# Altium schematic sheet Bluetooth.SchDoc
size A4
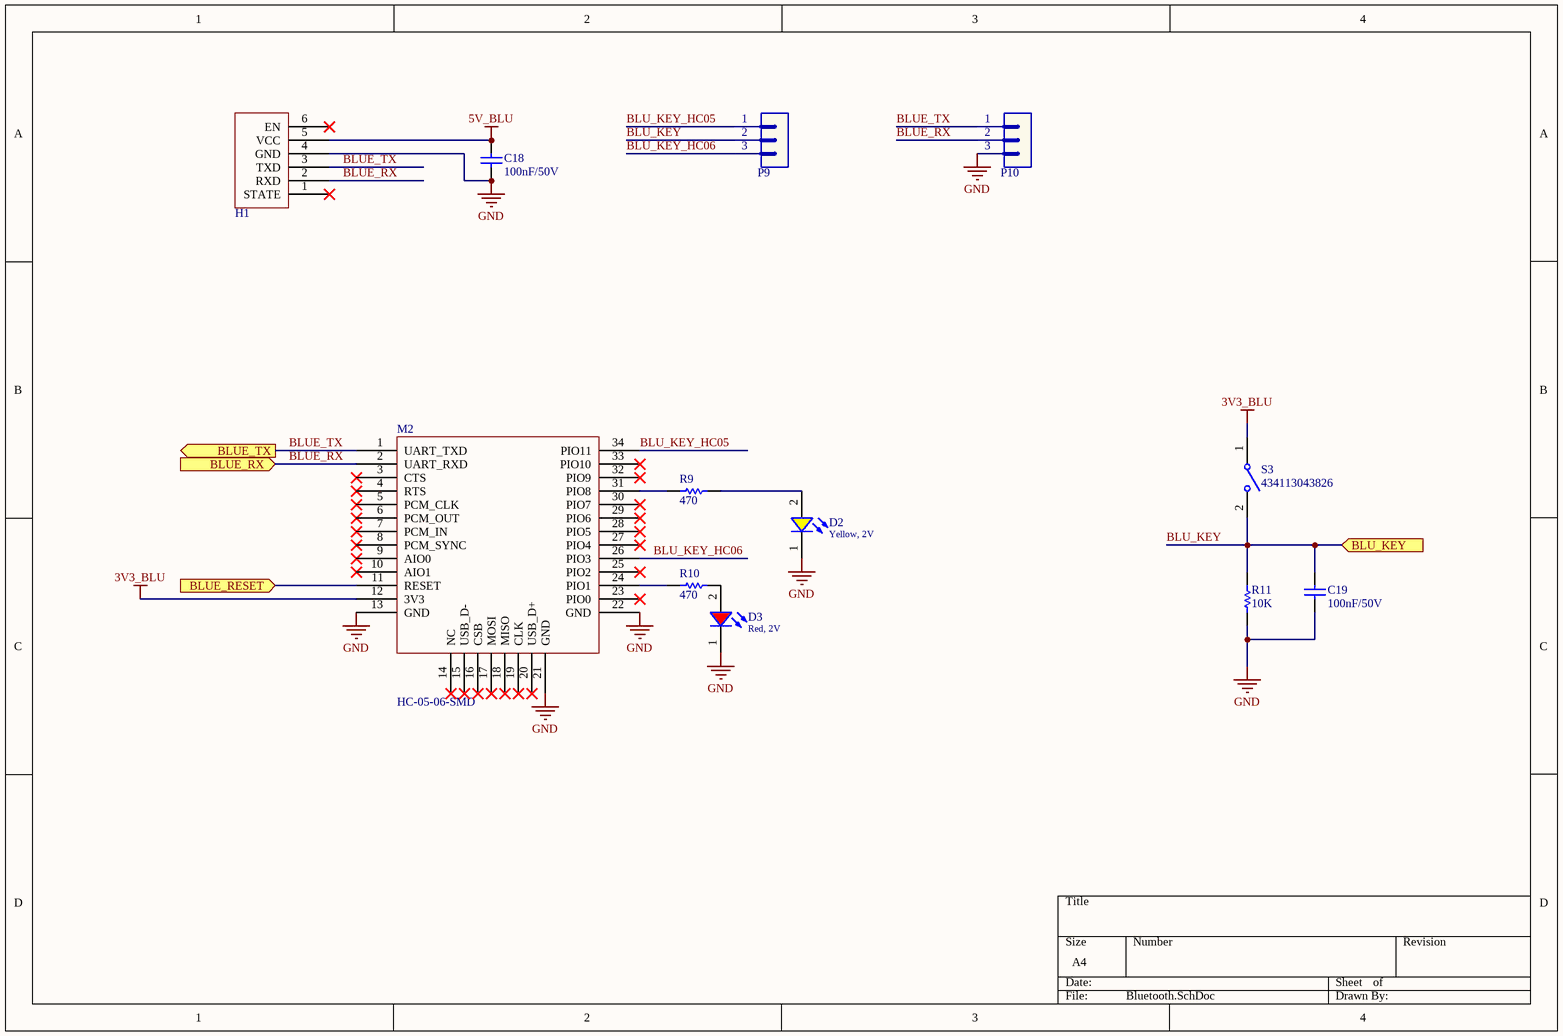
[diagram p0: Bluetooth.SchDoc]

## Parts
C18  value 100nF/50V  [CAP-SM-0805]  (hidden comment: Cap-100nF-50V-0805)
C19  value 100nF/50V  [CAP-SM-0805]  (hidden comment: Cap-100nF-50V-0805)
D2  Yellow, 2V  [WL-SMCW_0805]
D3  Red, 2V  [WL-SMCW_0805]
H1  HC-05-06-TH  [HC-05-06-TH]  (value not drawn)
M2  HC-05-06-SMD  [HC-05-06-SMD]
P9  Header 3  [JP3]  (value not drawn)
P10  Header 3  [JP3]  (value not drawn)
R9  value 470  [RES-SM-0805]  (hidden comment: Res-470-0805)
R10  value 470  [RES-SM-0805]  (hidden comment: Res-470-0805)
R11  value 10K  [RES-SM-0805]  (hidden comment: Res-10k-0805)
S3  434113043826  [434113043826]

## Ports
BLU_KEY (in), BLUE_RESET (in), BLUE_RX (in), BLUE_TX (out)

## Nets
3V3_BLU: M2.12(3V3) S3.1
5V_BLU: C18.2 H1.5(VCC)
GND: C18.1 C19.2 D2.1(K) D3.1(K) H1.4(GND) M2.13(GND) M2.21(GND) M2.22(GND) P10.3 R11.1
BLU_KEY: C19.1 P9.2 R11.2 S3.2 ; port BLU_KEY
BLU_KEY_HC05: M2.34(PIO11) P9.1
BLU_KEY_HC06: M2.26(PIO3) P9.3
BLUE_RESET: M2.11(RESET) ; port BLUE_RESET
BLUE_RX: H1.2(RXD) M2.2(UART_RXD) P10.2 ; port BLUE_RX
BLUE_TX: H1.3(TXD) M2.1(UART_TXD) P10.1 ; port BLUE_TX
NetD2_2: D2.2(A) R9.2
NetD3_2: D3.2(A) R10.2
NetM2_24: M2.24(PIO1) R10.1
NetM2_31: M2.31(PIO8) R9.1

Not connected (* = marked no-connect by the designer): H1 1(STATE)* 6(EN)*; M2 3(CTS)* 4(RTS)* 5(PCM_CLK)* 6(PCM_OUT)* 7(PCM_IN)* 8(PCM_SYNC)* 9(AIO0)* 10(AIO1)* 14(NC)* 15(USB_D-)* 16(CSB)* 17(MOSI)* 18(MISO)* 19(CLK)* 20(USB_D+)* 23(PIO0)* 25(PIO2)* 27(PIO4)* 28(PIO5)* 29(PIO6)* 30(PIO7)* 32(PIO9)* 33(PIO10)*

## Library data of the parts
C18 C19 = Cap-100nF-50V-0805: CAP CER 0.1UF 50V Y5V 0805; Manufacturer: Samsung Electro-Mechanics; Manufacturer Part Number: CL21F104ZBCNNNC; Local Supplier: thegioiic; Local Supplier Link: https://thegioiic.com/products/tu-100nf-0-1uf-50v-0805; Supplier 1: Digikey; Supplier 1 Part Number: 1276-1007-1-ND; Supplier 1 Link: https://www.digikey.com/product-detail/en/samsung-electro-mechanics/CL21F104ZBCNNNC/1276-1007-1-ND/3889093
D2 = 150080YS75000: WL-SMCW SMT Mono-color Chip LED Waterclear, size 0805, Yellow, 2V, 140deg; Chip Technology: AlInGaP; Dominant Wavelength typ.: 590nm; Luminous Intensity typ.: 120mcd; Peak Wavelength typ.: 595nm; Viewing Angle: 140deg; ComponentLink1Description: Manufacturer; ComponentLink1URL: http://www.we-online.de; ComponentLink2URL: https://www.we-online.com/catalog/datasheet/150080YS75000.pdf; ComponentLink2Description: Datasheet; Forward Voltage typ.: 2V; Emitting Color: Yellow; Mounting Technology: SMT; Operating Temperature: -40 to +85degC; Published Date: December 2019; Part Number: 150080YS75000; Packaging: Tape and Reel; Size: 0805; Publisher: Wurth Elektronik
D3 = 150080RS75000: WL-SMCW SMT Mono-color Chip LED Waterclear, size 0805, Red, 2V, 140deg; Chip Technology: AlInGaP; Dominant Wavelength typ.: 625nm; Luminous Intensity typ.: 150mcd; Peak Wavelength typ.: 630nm; Viewing Angle: 140deg; ComponentLink1Description: Manufacturer; ComponentLink1URL: http://www.we-online.de; ComponentLink2URL: https://www.we-online.com/catalog/datasheet/150080RS75000.pdf; ComponentLink2Description: Datasheet; Forward Voltage typ.: 2V; Emitting Color: Red; Mounting Technology: SMT; Operating Temperature: -40 to +85degC; Published Date: December 2019; Part Number: 150080RS75000; Packaging: Tape and Reel; Size: 0805; Publisher: Wurth Elektronik
P9 P10 = Header 3: Header, 3-Pin; LatestRevisionDate: 17-Jul-2002; LatestRevisionNote: Re-released for DXP Platform.; Publisher: Altium Limited
R9 R10 = Res-470-0805: RES 470 OHM JUMPER 0805; Manufacturer: YAG6006CT-ND; Manufacturer Part Number: PE0805FRF7W0R047L; Local Supplier: thegioiic; Local Supplier Link: https://www.thegioiic.com/products/dien-tro-470-kohm-0805-5; Supplier 1: Digikey; Supplier 1 Link: https://www.digikey.com/product-detail/en/yageo/PE0805FRF7W0R047L/YAG6006CT-ND/9696460; Supplier 1 Part Number: YAG6006CT-ND
R11 = Res-10k-0805: RES 10K OHM 1% 1/4W 0805; Manufacturer: Stackpole Electronics Inc; Manufacturer Part Number: RNCP0805FTD10K0; Local Supplier: thegioiic; Local Supplier Link: https://thegioiic.com/products/dien-tro-10k-ohm-0805-5; Supplier 1: Digikey; Supplier 1 Link: https://www.digikey.com/product-detail/en/stackpole-electronics-inc/RNCP0805FTD10K0/RNCP0805FTD10K0CT-ND/2240601; Supplier 1 Part Number: RNCP0805FTD10K0CT-ND
S3 = 434113043826: WS-TASV J-Bend SMT Tact Switch 6x3.5mm, height 4.3mm, 260gf; Rated Voltage: 12VDC; Rated Current: 50mA; Washable: No; ComponentLink1Description: Manufacturer; ComponentLink1URL: http://www.we-online.de; ComponentLink2Description: Datasheet; ComponentLink2URL: https://katalog.we-online.com/em/datasheet/434113043826.pdf; Operating Temperature: -40 to +85degC; Part Number: 434113043826; Published Date: September 2019; Contact Material: Stainless Steel; Height: 4.3mm; Mounting Technology: SMT; Contact Plating: Silver; Operation Force: 260gf; Packaging: Tape and Reel; Terminal Material: Copper Alloy; Publisher: Wurth Elektronik; Terminal Plating: Silver
H1 = HC-05-06-TH: Local Supplier: HShop; Local Supplier Link: https://hshop.vn/products/mach-thu-phat-bluetooth-hc-06-do-ra-chon-slave; Local Supplier Part Number: HS000882; Manufacturer: *; Manufacturer Part Number: *
M2 = HC-05-06-SMD: Local Supplier: HShop; Local Supplier Link: https://hshop.vn/products/mach-thu-phat-bluetooth-hc-06-chua-ra-chon-slave; Local Supplier Part Number: HS000881; Manufacturer: *; Manufacturer Part Number: *